# Altium schematic sheet Sheet1.SchDoc
size A0; SheetNumber: 1; SheetTotal: 1
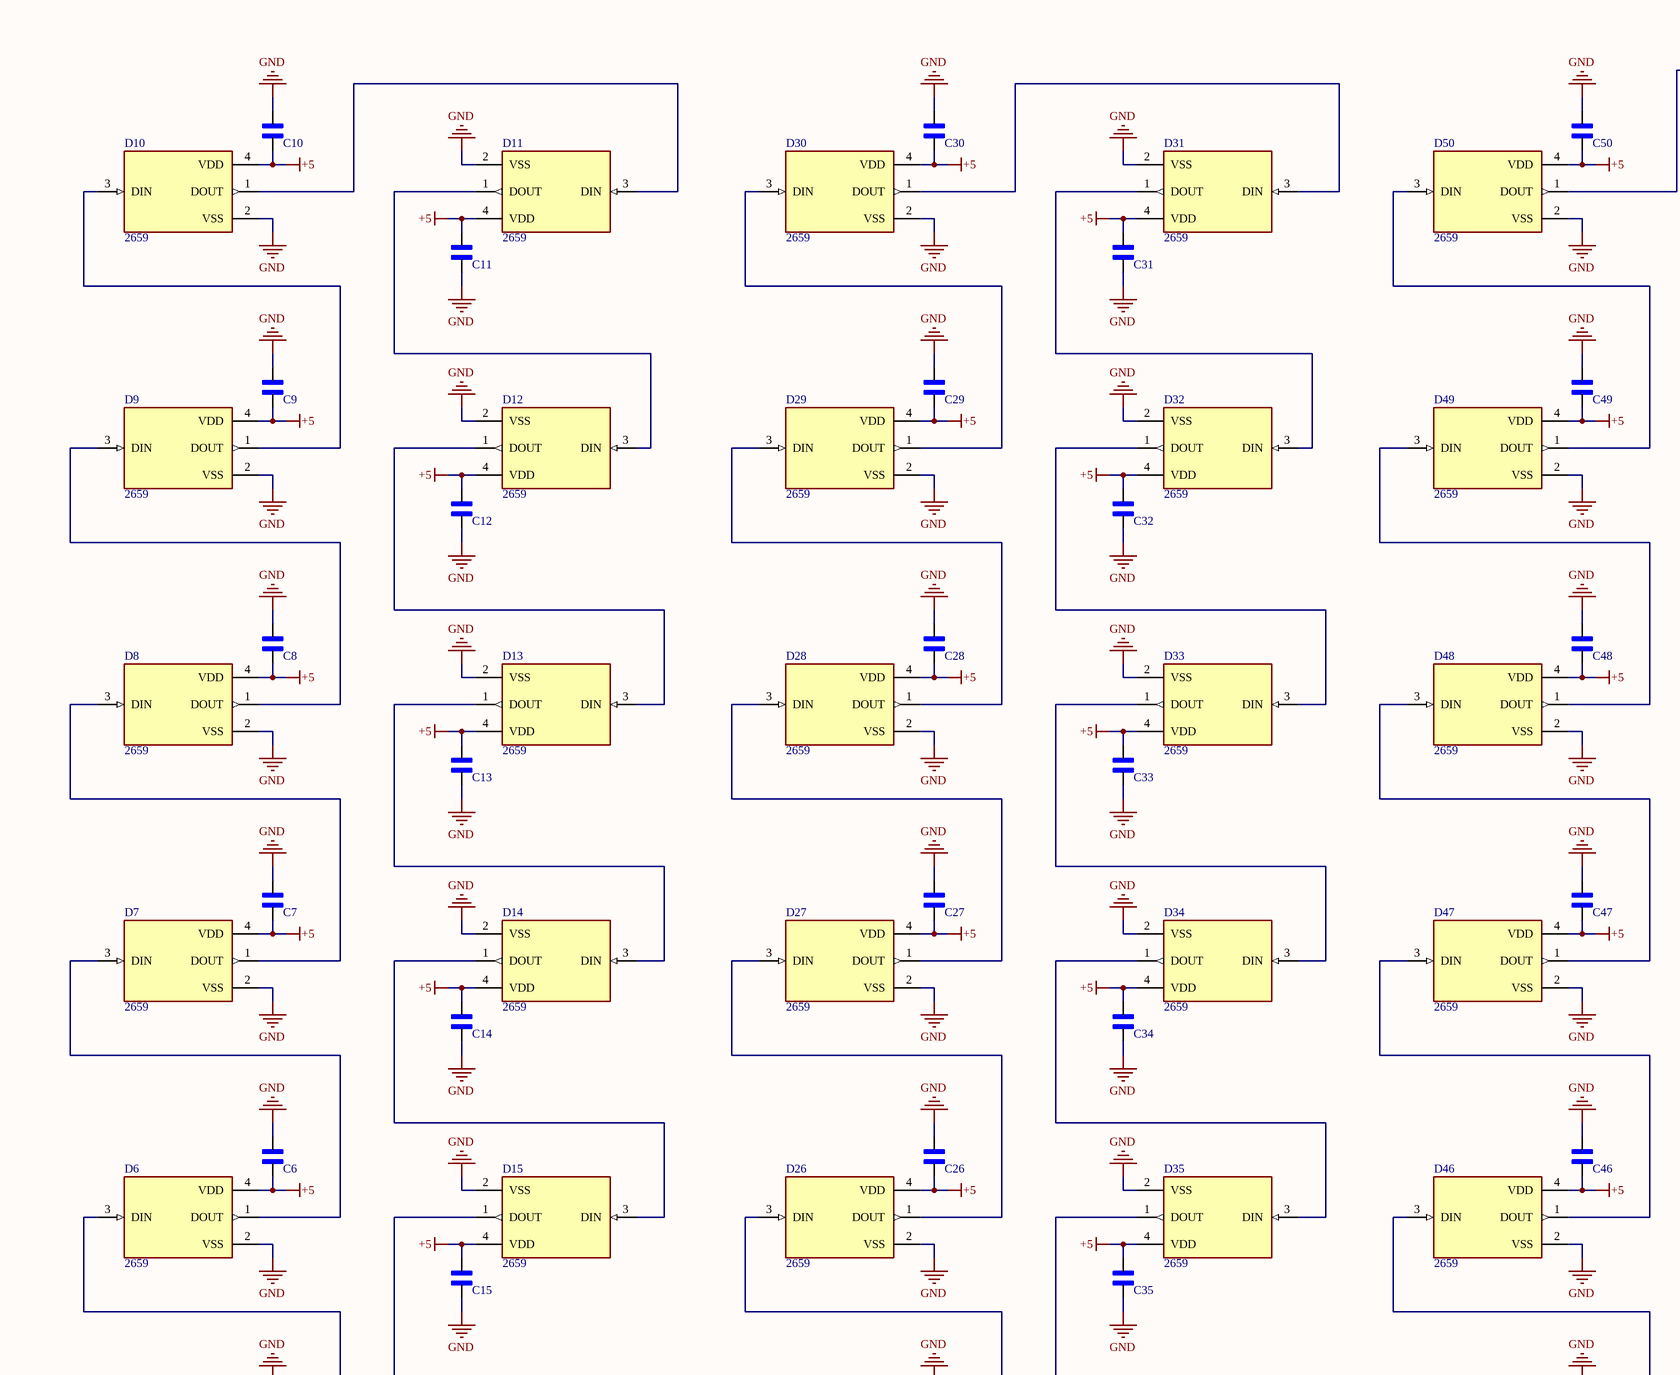
[diagram p0: Sheet1.SchDoc, top left]
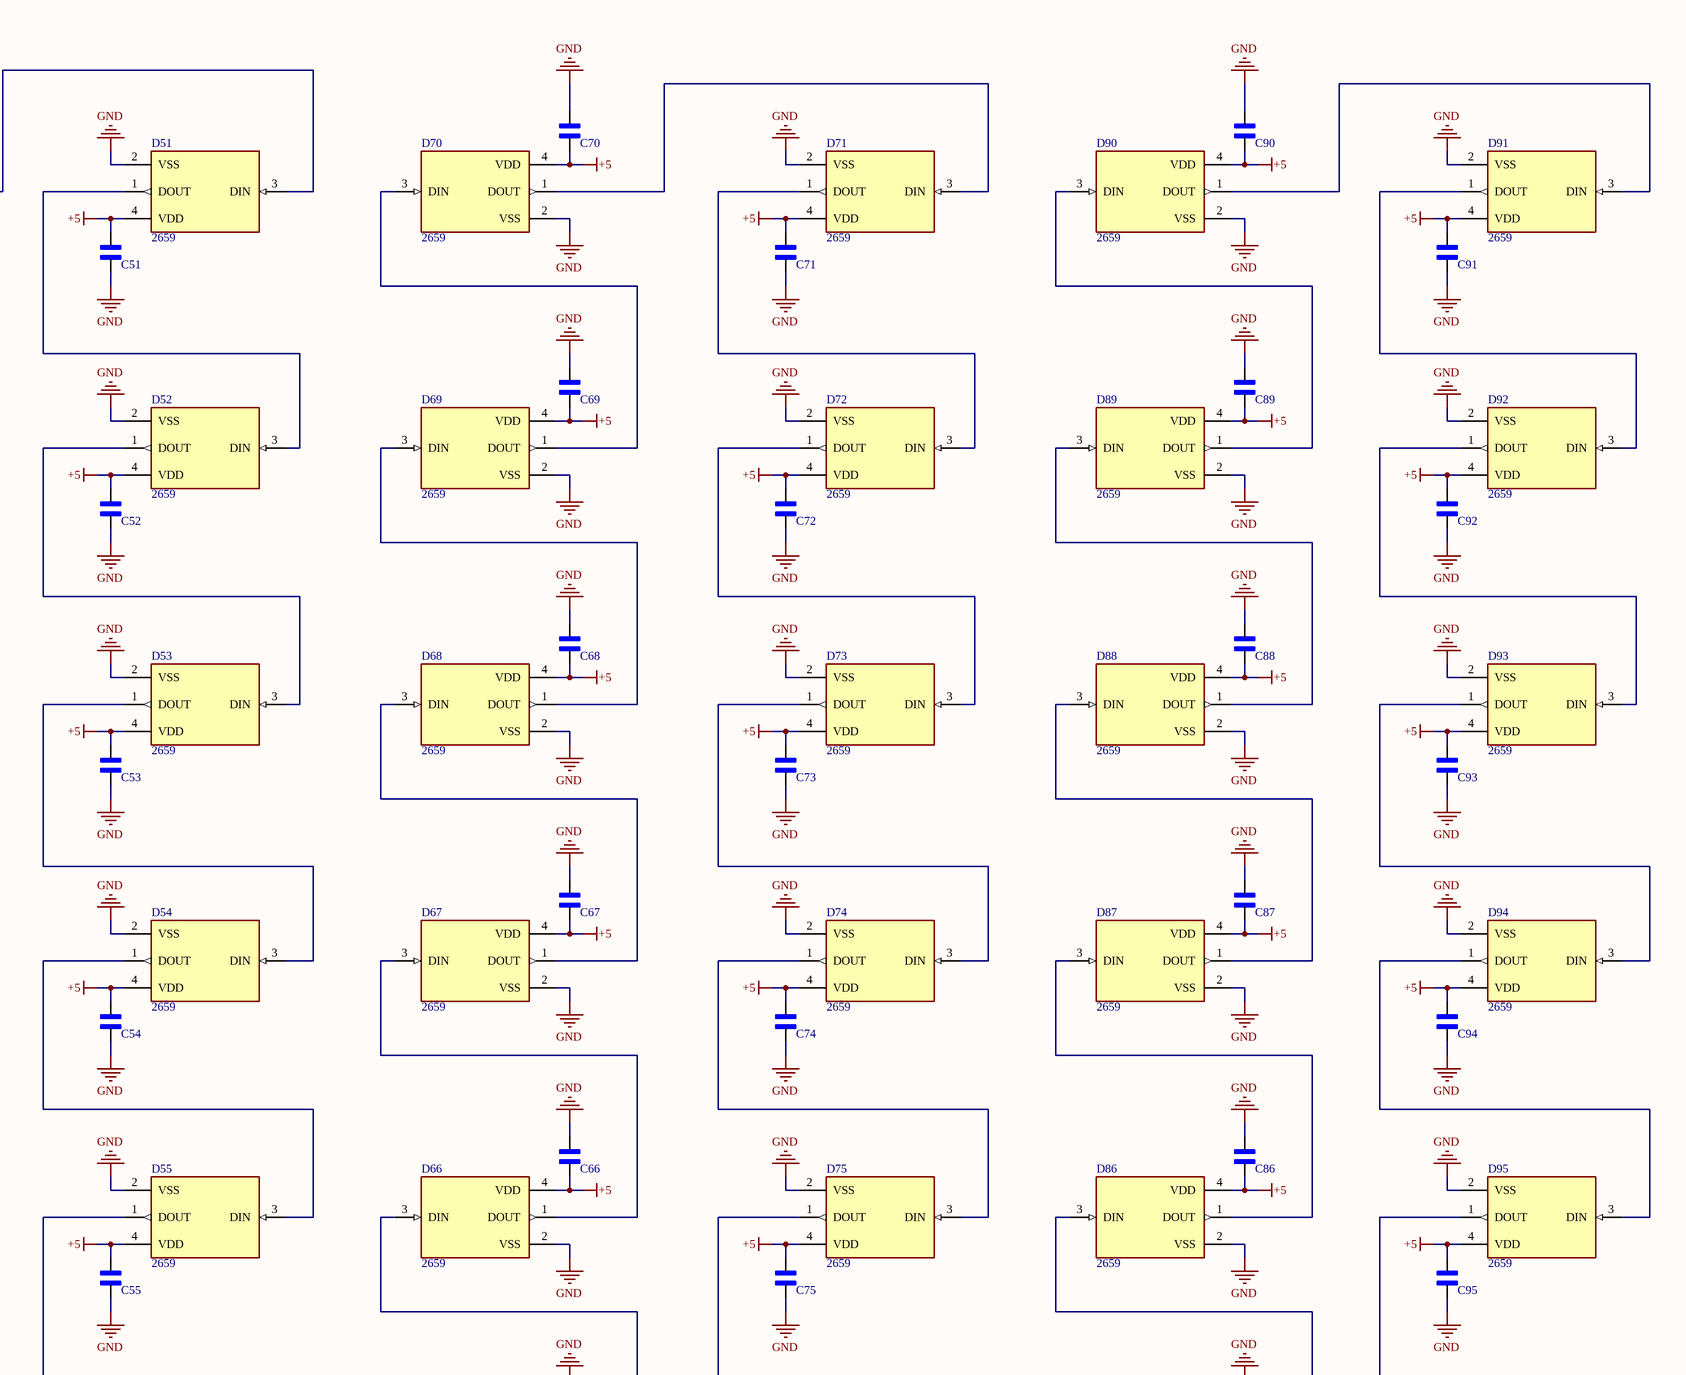
[diagram p1: Sheet1.SchDoc, top right]
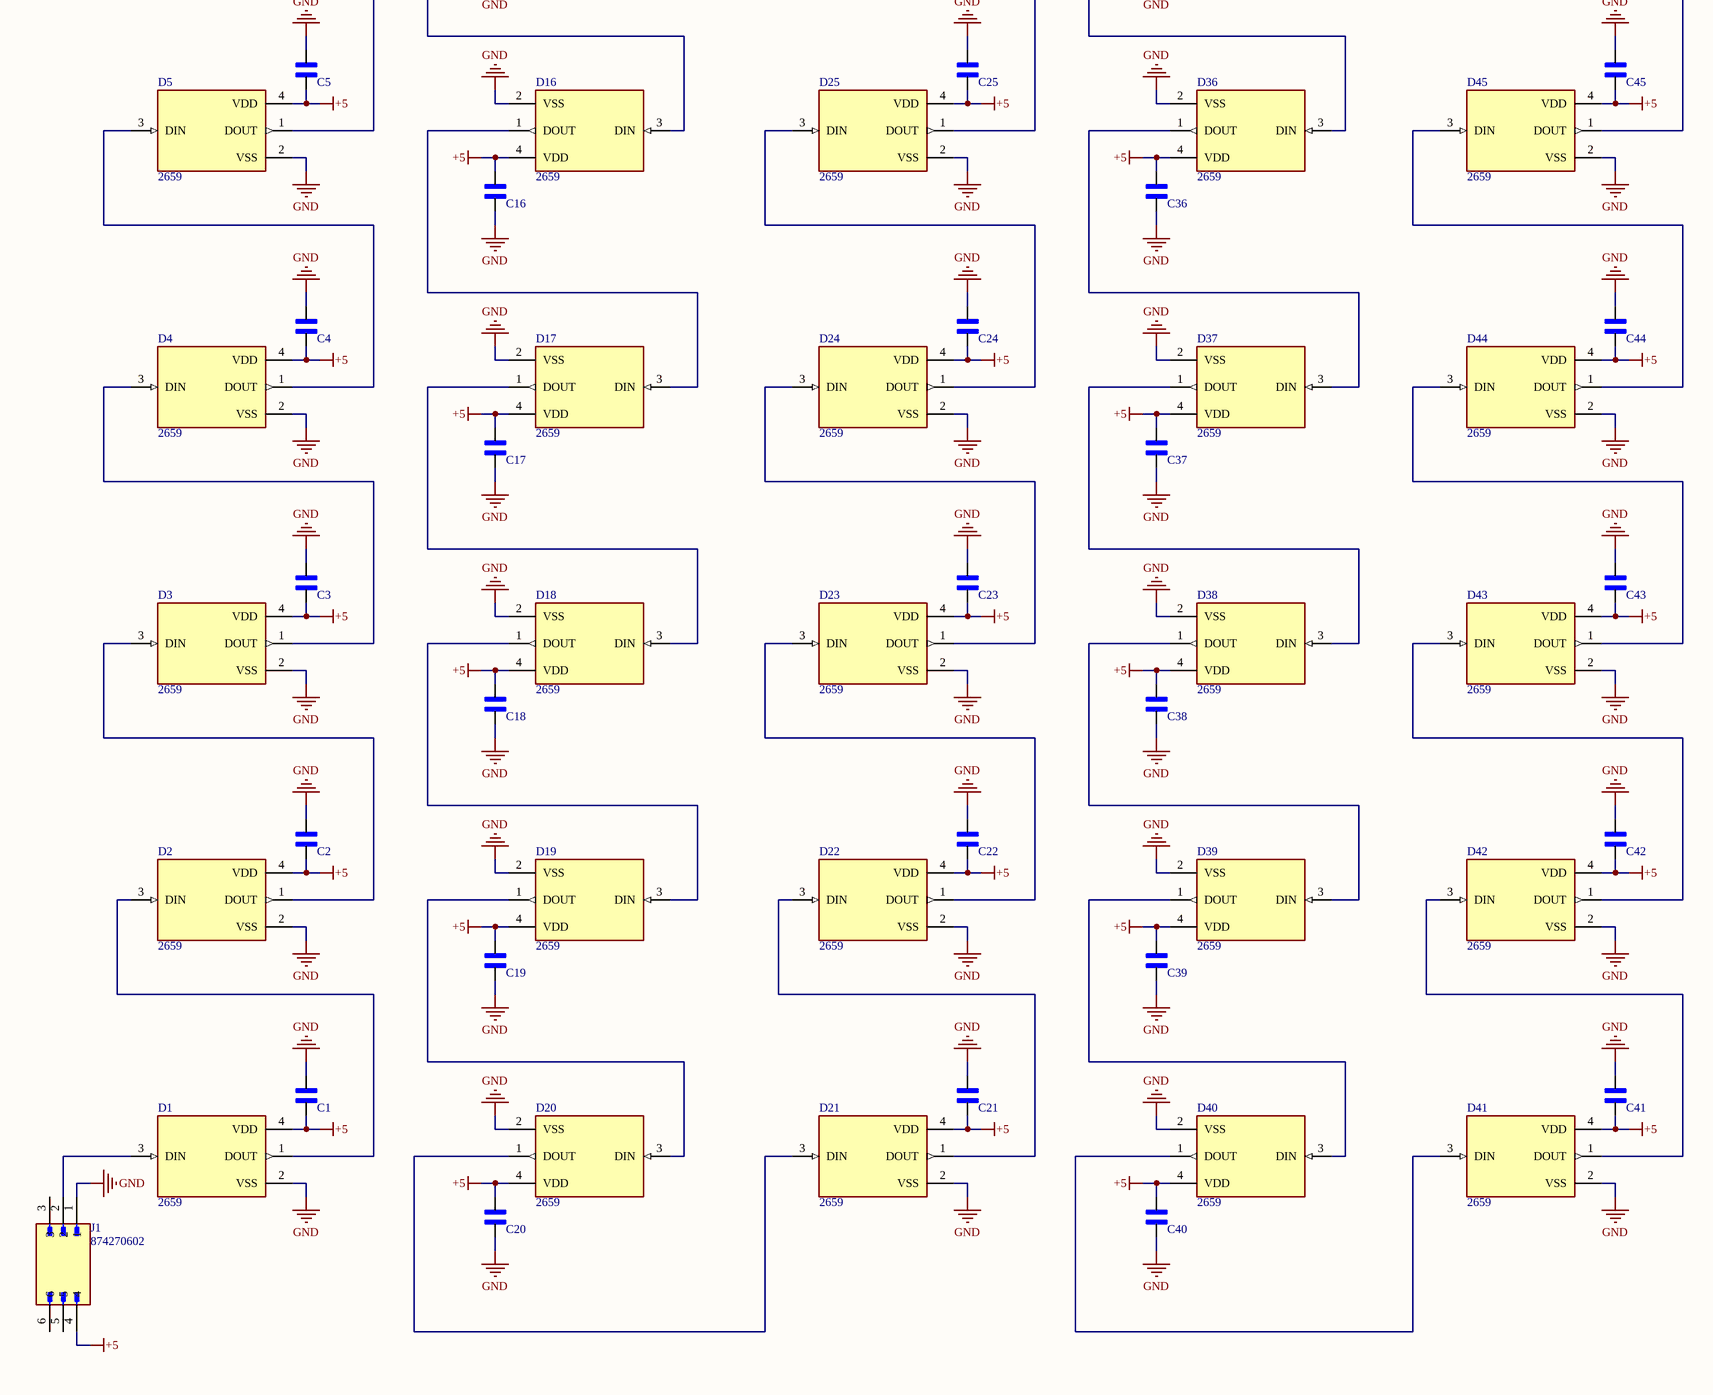
[diagram p2: Sheet1.SchDoc, bottom left]
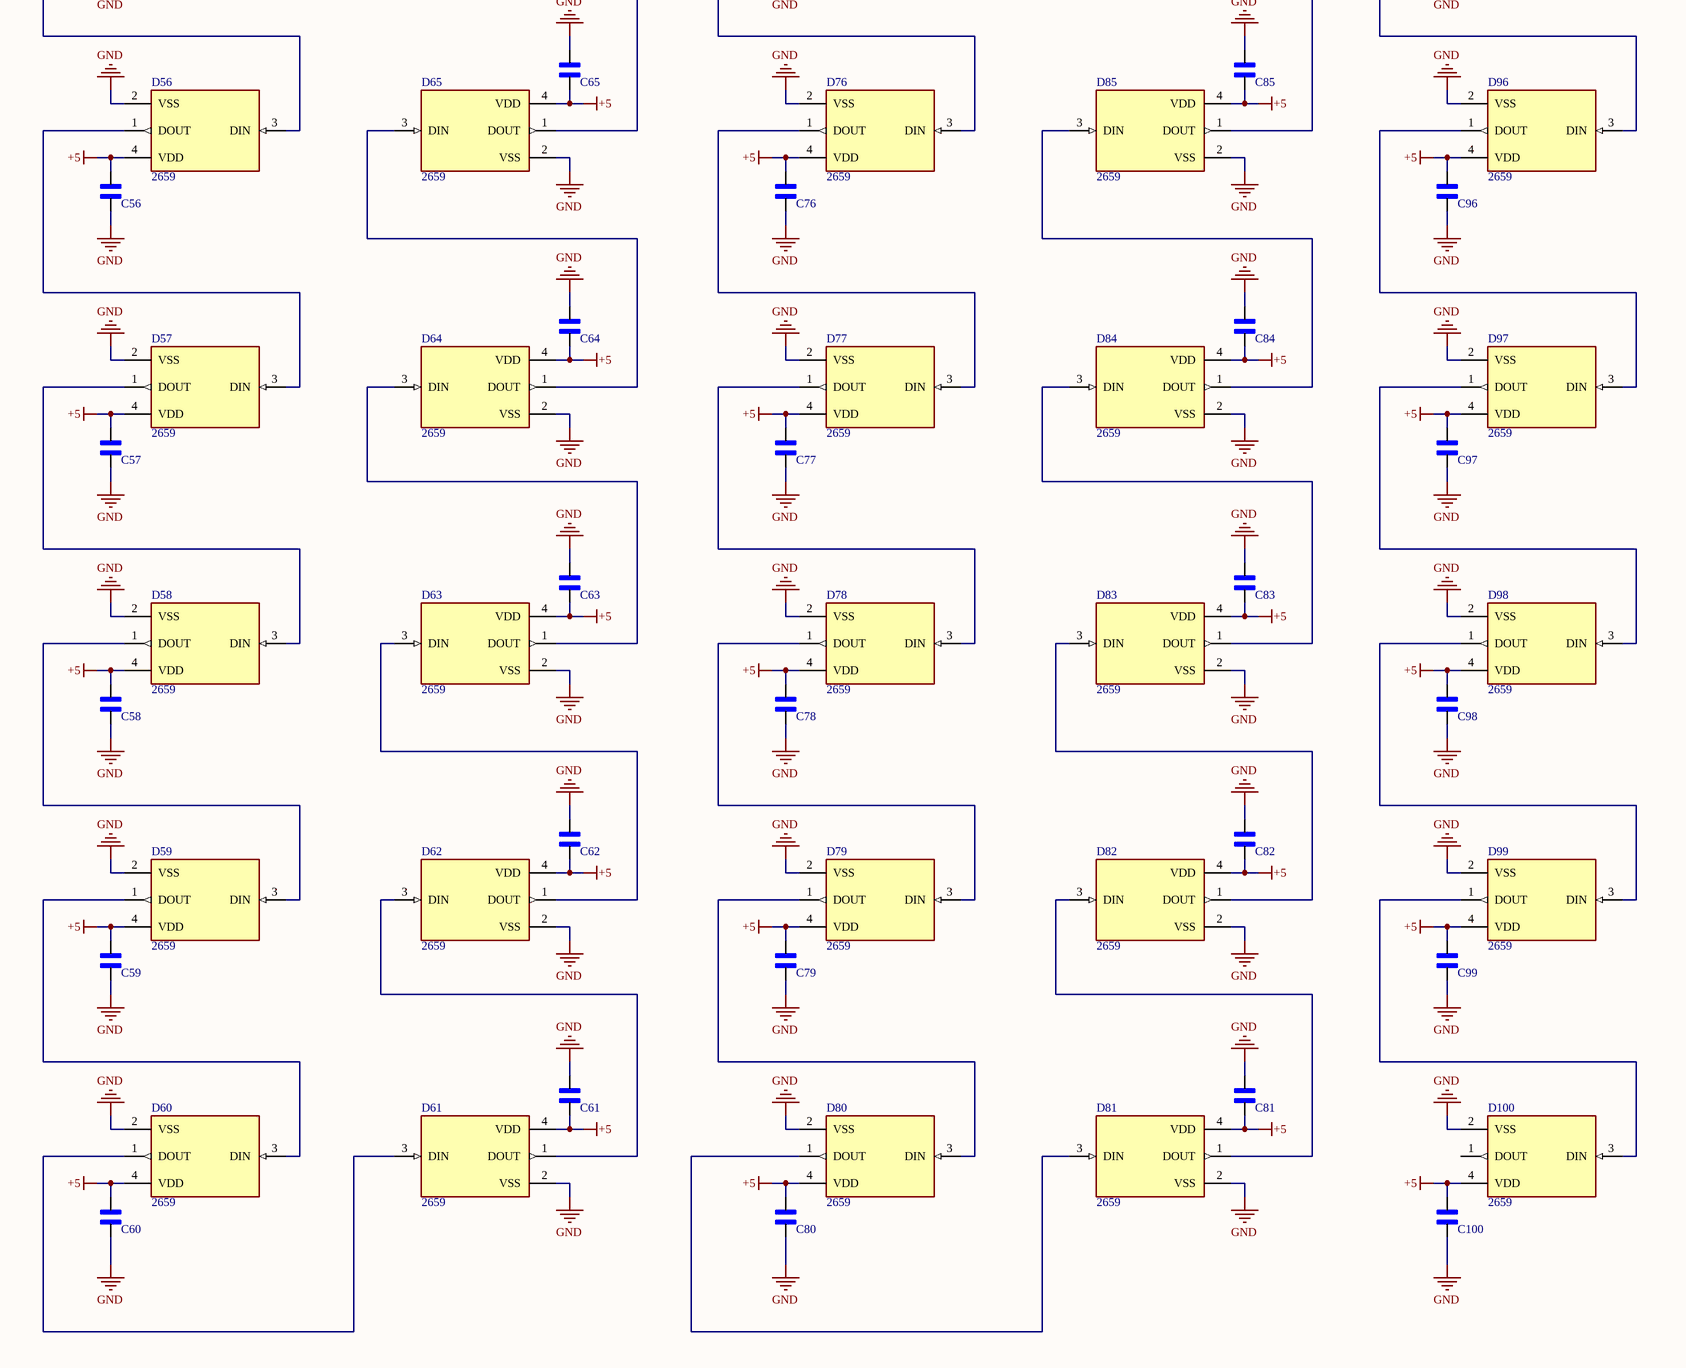
[diagram p3: Sheet1.SchDoc, bottom right]

## Parts
C1  CL10B104KB8NNNC  [CAPC1608X90N]  (value not drawn)
C2  CL10B104KB8NNNC  [CAPC1608X90N]  (value not drawn)
C3  CL10B104KB8NNNC  [CAPC1608X90N]  (value not drawn)
C4  CL10B104KB8NNNC  [CAPC1608X90N]  (value not drawn)
C5  CL10B104KB8NNNC  [CAPC1608X90N]  (value not drawn)
C6  CL10B104KB8NNNC  [CAPC1608X90N]  (value not drawn)
C7  CL10B104KB8NNNC  [CAPC1608X90N]  (value not drawn)
C8  CL10B104KB8NNNC  [CAPC1608X90N]  (value not drawn)
C9  CL10B104KB8NNNC  [CAPC1608X90N]  (value not drawn)
C10  CL10B104KB8NNNC  [CAPC1608X90N]  (value not drawn)
C11  CL10B104KB8NNNC  [CAPC1608X90N]  (value not drawn)
C12  CL10B104KB8NNNC  [CAPC1608X90N]  (value not drawn)
C13  CL10B104KB8NNNC  [CAPC1608X90N]  (value not drawn)
C14  CL10B104KB8NNNC  [CAPC1608X90N]  (value not drawn)
C15  CL10B104KB8NNNC  [CAPC1608X90N]  (value not drawn)
C16  CL10B104KB8NNNC  [CAPC1608X90N]  (value not drawn)
C17  CL10B104KB8NNNC  [CAPC1608X90N]  (value not drawn)
C18  CL10B104KB8NNNC  [CAPC1608X90N]  (value not drawn)
C19  CL10B104KB8NNNC  [CAPC1608X90N]  (value not drawn)
C20  CL10B104KB8NNNC  [CAPC1608X90N]  (value not drawn)
C21  CL10B104KB8NNNC  [CAPC1608X90N]  (value not drawn)
C22  CL10B104KB8NNNC  [CAPC1608X90N]  (value not drawn)
C23  CL10B104KB8NNNC  [CAPC1608X90N]  (value not drawn)
C24  CL10B104KB8NNNC  [CAPC1608X90N]  (value not drawn)
C25  CL10B104KB8NNNC  [CAPC1608X90N]  (value not drawn)
C26  CL10B104KB8NNNC  [CAPC1608X90N]  (value not drawn)
C27  CL10B104KB8NNNC  [CAPC1608X90N]  (value not drawn)
C28  CL10B104KB8NNNC  [CAPC1608X90N]  (value not drawn)
C29  CL10B104KB8NNNC  [CAPC1608X90N]  (value not drawn)
C30  CL10B104KB8NNNC  [CAPC1608X90N]  (value not drawn)
C31  CL10B104KB8NNNC  [CAPC1608X90N]  (value not drawn)
C32  CL10B104KB8NNNC  [CAPC1608X90N]  (value not drawn)
C33  CL10B104KB8NNNC  [CAPC1608X90N]  (value not drawn)
C34  CL10B104KB8NNNC  [CAPC1608X90N]  (value not drawn)
C35  CL10B104KB8NNNC  [CAPC1608X90N]  (value not drawn)
C36  CL10B104KB8NNNC  [CAPC1608X90N]  (value not drawn)
C37  CL10B104KB8NNNC  [CAPC1608X90N]  (value not drawn)
C38  CL10B104KB8NNNC  [CAPC1608X90N]  (value not drawn)
C39  CL10B104KB8NNNC  [CAPC1608X90N]  (value not drawn)
C40  CL10B104KB8NNNC  [CAPC1608X90N]  (value not drawn)
C41  CL10B104KB8NNNC  [CAPC1608X90N]  (value not drawn)
C42  CL10B104KB8NNNC  [CAPC1608X90N]  (value not drawn)
C43  CL10B104KB8NNNC  [CAPC1608X90N]  (value not drawn)
C44  CL10B104KB8NNNC  [CAPC1608X90N]  (value not drawn)
C45  CL10B104KB8NNNC  [CAPC1608X90N]  (value not drawn)
C46  CL10B104KB8NNNC  [CAPC1608X90N]  (value not drawn)
C47  CL10B104KB8NNNC  [CAPC1608X90N]  (value not drawn)
C48  CL10B104KB8NNNC  [CAPC1608X90N]  (value not drawn)
C49  CL10B104KB8NNNC  [CAPC1608X90N]  (value not drawn)
C50  CL10B104KB8NNNC  [CAPC1608X90N]  (value not drawn)
C51  CL10B104KB8NNNC  [CAPC1608X90N]  (value not drawn)
C52  CL10B104KB8NNNC  [CAPC1608X90N]  (value not drawn)
C53  CL10B104KB8NNNC  [CAPC1608X90N]  (value not drawn)
C54  CL10B104KB8NNNC  [CAPC1608X90N]  (value not drawn)
C55  CL10B104KB8NNNC  [CAPC1608X90N]  (value not drawn)
C56  CL10B104KB8NNNC  [CAPC1608X90N]  (value not drawn)
C57  CL10B104KB8NNNC  [CAPC1608X90N]  (value not drawn)
C58  CL10B104KB8NNNC  [CAPC1608X90N]  (value not drawn)
C59  CL10B104KB8NNNC  [CAPC1608X90N]  (value not drawn)
C60  CL10B104KB8NNNC  [CAPC1608X90N]  (value not drawn)
C61  CL10B104KB8NNNC  [CAPC1608X90N]  (value not drawn)
C62  CL10B104KB8NNNC  [CAPC1608X90N]  (value not drawn)
C63  CL10B104KB8NNNC  [CAPC1608X90N]  (value not drawn)
C64  CL10B104KB8NNNC  [CAPC1608X90N]  (value not drawn)
C65  CL10B104KB8NNNC  [CAPC1608X90N]  (value not drawn)
C66  CL10B104KB8NNNC  [CAPC1608X90N]  (value not drawn)
C67  CL10B104KB8NNNC  [CAPC1608X90N]  (value not drawn)
C68  CL10B104KB8NNNC  [CAPC1608X90N]  (value not drawn)
C69  CL10B104KB8NNNC  [CAPC1608X90N]  (value not drawn)
C70  CL10B104KB8NNNC  [CAPC1608X90N]  (value not drawn)
C71  CL10B104KB8NNNC  [CAPC1608X90N]  (value not drawn)
C72  CL10B104KB8NNNC  [CAPC1608X90N]  (value not drawn)
C73  CL10B104KB8NNNC  [CAPC1608X90N]  (value not drawn)
C74  CL10B104KB8NNNC  [CAPC1608X90N]  (value not drawn)
C75  CL10B104KB8NNNC  [CAPC1608X90N]  (value not drawn)
C76  CL10B104KB8NNNC  [CAPC1608X90N]  (value not drawn)
C77  CL10B104KB8NNNC  [CAPC1608X90N]  (value not drawn)
C78  CL10B104KB8NNNC  [CAPC1608X90N]  (value not drawn)
C79  CL10B104KB8NNNC  [CAPC1608X90N]  (value not drawn)
C80  CL10B104KB8NNNC  [CAPC1608X90N]  (value not drawn)
C81  CL10B104KB8NNNC  [CAPC1608X90N]  (value not drawn)
C82  CL10B104KB8NNNC  [CAPC1608X90N]  (value not drawn)
C83  CL10B104KB8NNNC  [CAPC1608X90N]  (value not drawn)
C84  CL10B104KB8NNNC  [CAPC1608X90N]  (value not drawn)
C85  CL10B104KB8NNNC  [CAPC1608X90N]  (value not drawn)
C86  CL10B104KB8NNNC  [CAPC1608X90N]  (value not drawn)
C87  CL10B104KB8NNNC  [CAPC1608X90N]  (value not drawn)
C88  CL10B104KB8NNNC  [CAPC1608X90N]  (value not drawn)
C89  CL10B104KB8NNNC  [CAPC1608X90N]  (value not drawn)
C90  CL10B104KB8NNNC  [CAPC1608X90N]  (value not drawn)
C91  CL10B104KB8NNNC  [CAPC1608X90N]  (value not drawn)
C92  CL10B104KB8NNNC  [CAPC1608X90N]  (value not drawn)
C93  CL10B104KB8NNNC  [CAPC1608X90N]  (value not drawn)
C94  CL10B104KB8NNNC  [CAPC1608X90N]  (value not drawn)
C95  CL10B104KB8NNNC  [CAPC1608X90N]  (value not drawn)
C96  CL10B104KB8NNNC  [CAPC1608X90N]  (value not drawn)
C97  CL10B104KB8NNNC  [CAPC1608X90N]  (value not drawn)
C98  CL10B104KB8NNNC  [CAPC1608X90N]  (value not drawn)
C99  CL10B104KB8NNNC  [CAPC1608X90N]  (value not drawn)
C100  CL10B104KB8NNNC  [CAPC1608X90N]  (value not drawn)
D1  2659  [2659]
D2  2659  [2659]
D3  2659  [2659]
D4  2659  [2659]
D5  2659  [2659]
D6  2659  [2659]
D7  2659  [2659]
D8  2659  [2659]
D9  2659  [2659]
D10  2659  [2659]
D11  2659  [2659]
D12  2659  [2659]
D13  2659  [2659]
D14  2659  [2659]
D15  2659  [2659]
D16  2659  [2659]
D17  2659  [2659]
D18  2659  [2659]
D19  2659  [2659]
D20  2659  [2659]
D21  2659  [2659]
D22  2659  [2659]
D23  2659  [2659]
D24  2659  [2659]
D25  2659  [2659]
D26  2659  [2659]
D27  2659  [2659]
D28  2659  [2659]
D29  2659  [2659]
D30  2659  [2659]
D31  2659  [2659]
D32  2659  [2659]
D33  2659  [2659]
D34  2659  [2659]
D35  2659  [2659]
D36  2659  [2659]
D37  2659  [2659]
D38  2659  [2659]
D39  2659  [2659]
D40  2659  [2659]
D41  2659  [2659]
D42  2659  [2659]
D43  2659  [2659]
D44  2659  [2659]
D45  2659  [2659]
D46  2659  [2659]
D47  2659  [2659]
D48  2659  [2659]
D49  2659  [2659]
D50  2659  [2659]
D51  2659  [2659]
D52  2659  [2659]
D53  2659  [2659]
D54  2659  [2659]
D55  2659  [2659]
D56  2659  [2659]
D57  2659  [2659]
D58  2659  [2659]
D59  2659  [2659]
D60  2659  [2659]
D61  2659  [2659]
D62  2659  [2659]
D63  2659  [2659]
D64  2659  [2659]
D65  2659  [2659]
D66  2659  [2659]
D67  2659  [2659]
D68  2659  [2659]
D69  2659  [2659]
D70  2659  [2659]
D71  2659  [2659]
D72  2659  [2659]
D73  2659  [2659]
D74  2659  [2659]
D75  2659  [2659]
D76  2659  [2659]
D77  2659  [2659]
D78  2659  [2659]
D79  2659  [2659]
D80  2659  [2659]
D81  2659  [2659]
D82  2659  [2659]
D83  2659  [2659]
D84  2659  [2659]
D85  2659  [2659]
D86  2659  [2659]
D87  2659  [2659]
D88  2659  [2659]
D89  2659  [2659]
D90  2659  [2659]
D91  2659  [2659]
D92  2659  [2659]
D93  2659  [2659]
D94  2659  [2659]
D95  2659  [2659]
D96  2659  [2659]
D97  2659  [2659]
D98  2659  [2659]
D99  2659  [2659]
D100  2659  [2659]
J1  874270602  [MOLEX_874270602]

## Nets
+5: C1.1 C2.1 C3.1 C4.1 C5.1 C6.1 C7.1 C8.1 C9.1 C10.1 C11.1 C12.1 C13.1 C14.1 C15.1 C16.1 C17.1 C18.1 C19.1 C20.1 C21.1 C22.1 C23.1 C24.1 C25.1 C26.1 C27.1 C28.1 C29.1 C30.1 C31.1 C32.1 C33.1 C34.1 C35.1 C36.1 C37.1 C38.1 C39.1 C40.1 C41.1 C42.1 C43.1 C44.1 C45.1 C46.1 C47.1 C48.1 C49.1 C50.1 C51.1 C52.1 C53.1 C54.1 C55.1 C56.1 C57.1 C58.1 C59.1 C60.1 C61.1 C62.1 C63.1 C64.1 C65.1 C66.1 C67.1 C68.1 C69.1 C70.1 C71.1 C72.1 C73.1 C74.1 C75.1 C76.1 C77.1 C78.1 C79.1 C80.1 C81.1 C82.1 C83.1 C84.1 C85.1 C86.1 C87.1 C88.1 C89.1 C90.1 C91.1 C92.1 C93.1 C94.1 C95.1 C96.1 C97.1 C98.1 C99.1 C100.1 D1.4(VDD) D2.4(VDD) D3.4(VDD) D4.4(VDD) D5.4(VDD) D6.4(VDD) D7.4(VDD) D8.4(VDD) D9.4(VDD) D10.4(VDD) D11.4(VDD) D12.4(VDD) D13.4(VDD) D14.4(VDD) D15.4(VDD) D16.4(VDD) D17.4(VDD) D18.4(VDD) D19.4(VDD) D20.4(VDD) D21.4(VDD) D22.4(VDD) D23.4(VDD) D24.4(VDD) D25.4(VDD) D26.4(VDD) D27.4(VDD) D28.4(VDD) D29.4(VDD) D30.4(VDD) D31.4(VDD) D32.4(VDD) D33.4(VDD) D34.4(VDD) D35.4(VDD) D36.4(VDD) D37.4(VDD) D38.4(VDD) D39.4(VDD) D40.4(VDD) D41.4(VDD) D42.4(VDD) D43.4(VDD) D44.4(VDD) D45.4(VDD) D46.4(VDD) D47.4(VDD) D48.4(VDD) D49.4(VDD) D50.4(VDD) D51.4(VDD) D52.4(VDD) D53.4(VDD) D54.4(VDD) D55.4(VDD) D56.4(VDD) D57.4(VDD) D58.4(VDD) D59.4(VDD) D60.4(VDD) D61.4(VDD) D62.4(VDD) D63.4(VDD) D64.4(VDD) D65.4(VDD) D66.4(VDD) D67.4(VDD) D68.4(VDD) D69.4(VDD) D70.4(VDD) D71.4(VDD) D72.4(VDD) D73.4(VDD) D74.4(VDD) D75.4(VDD) D76.4(VDD) D77.4(VDD) D78.4(VDD) D79.4(VDD) D80.4(VDD) D81.4(VDD) D82.4(VDD) D83.4(VDD) D84.4(VDD) D85.4(VDD) D86.4(VDD) D87.4(VDD) D88.4(VDD) D89.4(VDD) D90.4(VDD) D91.4(VDD) D92.4(VDD) D93.4(VDD) D94.4(VDD) D95.4(VDD) D96.4(VDD) D97.4(VDD) D98.4(VDD) D99.4(VDD) D100.4(VDD) J1.4
GND: C1.2 C2.2 C3.2 C4.2 C5.2 C6.2 C7.2 C8.2 C9.2 C10.2 C11.2 C12.2 C13.2 C14.2 C15.2 C16.2 C17.2 C18.2 C19.2 C20.2 C21.2 C22.2 C23.2 C24.2 C25.2 C26.2 C27.2 C28.2 C29.2 C30.2 C31.2 C32.2 C33.2 C34.2 C35.2 C36.2 C37.2 C38.2 C39.2 C40.2 C41.2 C42.2 C43.2 C44.2 C45.2 C46.2 C47.2 C48.2 C49.2 C50.2 C51.2 C52.2 C53.2 C54.2 C55.2 C56.2 C57.2 C58.2 C59.2 C60.2 C61.2 C62.2 C63.2 C64.2 C65.2 C66.2 C67.2 C68.2 C69.2 C70.2 C71.2 C72.2 C73.2 C74.2 C75.2 C76.2 C77.2 C78.2 C79.2 C80.2 C81.2 C82.2 C83.2 C84.2 C85.2 C86.2 C87.2 C88.2 C89.2 C90.2 C91.2 C92.2 C93.2 C94.2 C95.2 C96.2 C97.2 C98.2 C99.2 C100.2 D1.2(VSS) D2.2(VSS) D3.2(VSS) D4.2(VSS) D5.2(VSS) D6.2(VSS) D7.2(VSS) D8.2(VSS) D9.2(VSS) D10.2(VSS) D11.2(VSS) D12.2(VSS) D13.2(VSS) D14.2(VSS) D15.2(VSS) D16.2(VSS) D17.2(VSS) D18.2(VSS) D19.2(VSS) D20.2(VSS) D21.2(VSS) D22.2(VSS) D23.2(VSS) D24.2(VSS) D25.2(VSS) D26.2(VSS) D27.2(VSS) D28.2(VSS) D29.2(VSS) D30.2(VSS) D31.2(VSS) D32.2(VSS) D33.2(VSS) D34.2(VSS) D35.2(VSS) D36.2(VSS) D37.2(VSS) D38.2(VSS) D39.2(VSS) D40.2(VSS) D41.2(VSS) D42.2(VSS) D43.2(VSS) D44.2(VSS) D45.2(VSS) D46.2(VSS) D47.2(VSS) D48.2(VSS) D49.2(VSS) D50.2(VSS) D51.2(VSS) D52.2(VSS) D53.2(VSS) D54.2(VSS) D55.2(VSS) D56.2(VSS) D57.2(VSS) D58.2(VSS) D59.2(VSS) D60.2(VSS) D61.2(VSS) D62.2(VSS) D63.2(VSS) D64.2(VSS) D65.2(VSS) D66.2(VSS) D67.2(VSS) D68.2(VSS) D69.2(VSS) D70.2(VSS) D71.2(VSS) D72.2(VSS) D73.2(VSS) D74.2(VSS) D75.2(VSS) D76.2(VSS) D77.2(VSS) D78.2(VSS) D79.2(VSS) D80.2(VSS) D81.2(VSS) D82.2(VSS) D83.2(VSS) D84.2(VSS) D85.2(VSS) D86.2(VSS) D87.2(VSS) D88.2(VSS) D89.2(VSS) D90.2(VSS) D91.2(VSS) D92.2(VSS) D93.2(VSS) D94.2(VSS) D95.2(VSS) D96.2(VSS) D97.2(VSS) D98.2(VSS) D99.2(VSS) D100.2(VSS) J1.1
NetD1_1: D1.1(DOUT) D2.3(DIN)
NetD1_3: D1.3(DIN) J1.2
NetD2_1: D2.1(DOUT) D3.3(DIN)
NetD3_1: D3.1(DOUT) D4.3(DIN)
NetD4_1: D4.1(DOUT) D5.3(DIN)
NetD5_1: D5.1(DOUT) D6.3(DIN)
NetD6_1: D6.1(DOUT) D7.3(DIN)
NetD7_1: D7.1(DOUT) D8.3(DIN)
NetD8_1: D8.1(DOUT) D9.3(DIN)
NetD9_1: D9.1(DOUT) D10.3(DIN)
NetD10_1: D10.1(DOUT) D11.3(DIN)
NetD11_1: D11.1(DOUT) D12.3(DIN)
NetD12_1: D12.1(DOUT) D13.3(DIN)
NetD13_1: D13.1(DOUT) D14.3(DIN)
NetD14_1: D14.1(DOUT) D15.3(DIN)
NetD15_1: D15.1(DOUT) D16.3(DIN)
NetD16_1: D16.1(DOUT) D17.3(DIN)
NetD17_1: D17.1(DOUT) D18.3(DIN)
NetD18_1: D18.1(DOUT) D19.3(DIN)
NetD19_1: D19.1(DOUT) D20.3(DIN)
NetD20_1: D20.1(DOUT) D21.3(DIN)
NetD21_1: D21.1(DOUT) D22.3(DIN)
NetD22_1: D22.1(DOUT) D23.3(DIN)
NetD23_1: D23.1(DOUT) D24.3(DIN)
NetD24_1: D24.1(DOUT) D25.3(DIN)
NetD25_1: D25.1(DOUT) D26.3(DIN)
NetD26_1: D26.1(DOUT) D27.3(DIN)
NetD27_1: D27.1(DOUT) D28.3(DIN)
NetD28_1: D28.1(DOUT) D29.3(DIN)
NetD29_1: D29.1(DOUT) D30.3(DIN)
NetD30_1: D30.1(DOUT) D31.3(DIN)
NetD31_1: D31.1(DOUT) D32.3(DIN)
NetD32_1: D32.1(DOUT) D33.3(DIN)
NetD33_1: D33.1(DOUT) D34.3(DIN)
NetD34_1: D34.1(DOUT) D35.3(DIN)
NetD35_1: D35.1(DOUT) D36.3(DIN)
NetD36_1: D36.1(DOUT) D37.3(DIN)
NetD37_1: D37.1(DOUT) D38.3(DIN)
NetD38_1: D38.1(DOUT) D39.3(DIN)
NetD39_1: D39.1(DOUT) D40.3(DIN)
NetD40_1: D40.1(DOUT) D41.3(DIN)
NetD41_1: D41.1(DOUT) D42.3(DIN)
NetD42_1: D42.1(DOUT) D43.3(DIN)
NetD43_1: D43.1(DOUT) D44.3(DIN)
NetD44_1: D44.1(DOUT) D45.3(DIN)
NetD45_1: D45.1(DOUT) D46.3(DIN)
NetD46_1: D46.1(DOUT) D47.3(DIN)
NetD47_1: D47.1(DOUT) D48.3(DIN)
NetD48_1: D48.1(DOUT) D49.3(DIN)
NetD49_1: D49.1(DOUT) D50.3(DIN)
NetD50_1: D50.1(DOUT) D51.3(DIN)
NetD51_1: D51.1(DOUT) D52.3(DIN)
NetD52_1: D52.1(DOUT) D53.3(DIN)
NetD53_1: D53.1(DOUT) D54.3(DIN)
NetD54_1: D54.1(DOUT) D55.3(DIN)
NetD55_1: D55.1(DOUT) D56.3(DIN)
NetD56_1: D56.1(DOUT) D57.3(DIN)
NetD57_1: D57.1(DOUT) D58.3(DIN)
NetD58_1: D58.1(DOUT) D59.3(DIN)
NetD59_1: D59.1(DOUT) D60.3(DIN)
NetD60_1: D60.1(DOUT) D61.3(DIN)
NetD61_1: D61.1(DOUT) D62.3(DIN)
NetD62_1: D62.1(DOUT) D63.3(DIN)
NetD63_1: D63.1(DOUT) D64.3(DIN)
NetD64_1: D64.1(DOUT) D65.3(DIN)
NetD65_1: D65.1(DOUT) D66.3(DIN)
NetD66_1: D66.1(DOUT) D67.3(DIN)
NetD67_1: D67.1(DOUT) D68.3(DIN)
NetD68_1: D68.1(DOUT) D69.3(DIN)
NetD69_1: D69.1(DOUT) D70.3(DIN)
NetD70_1: D70.1(DOUT) D71.3(DIN)
NetD71_1: D71.1(DOUT) D72.3(DIN)
NetD72_1: D72.1(DOUT) D73.3(DIN)
NetD73_1: D73.1(DOUT) D74.3(DIN)
NetD74_1: D74.1(DOUT) D75.3(DIN)
NetD75_1: D75.1(DOUT) D76.3(DIN)
NetD76_1: D76.1(DOUT) D77.3(DIN)
NetD77_1: D77.1(DOUT) D78.3(DIN)
NetD78_1: D78.1(DOUT) D79.3(DIN)
NetD79_1: D79.1(DOUT) D80.3(DIN)
NetD80_1: D80.1(DOUT) D81.3(DIN)
NetD81_1: D81.1(DOUT) D82.3(DIN)
NetD82_1: D82.1(DOUT) D83.3(DIN)
NetD83_1: D83.1(DOUT) D84.3(DIN)
NetD84_1: D84.1(DOUT) D85.3(DIN)
NetD85_1: D85.1(DOUT) D86.3(DIN)
NetD86_1: D86.1(DOUT) D87.3(DIN)
NetD87_1: D87.1(DOUT) D88.3(DIN)
NetD88_1: D88.1(DOUT) D89.3(DIN)
NetD89_1: D89.1(DOUT) D90.3(DIN)
NetD90_1: D90.1(DOUT) D91.3(DIN)
NetD91_1: D91.1(DOUT) D92.3(DIN)
NetD92_1: D92.1(DOUT) D93.3(DIN)
NetD93_1: D93.1(DOUT) D94.3(DIN)
NetD94_1: D94.1(DOUT) D95.3(DIN)
NetD95_1: D95.1(DOUT) D96.3(DIN)
NetD96_1: D96.1(DOUT) D97.3(DIN)
NetD97_1: D97.1(DOUT) D98.3(DIN)
NetD98_1: D98.1(DOUT) D99.3(DIN)
NetD99_1: D99.1(DOUT) D100.3(DIN)

Not connected (* = marked no-connect by the designer): D100 1(DOUT); J1 3 5 6

## Library data of the parts
C1-C100 = CL10B104KB8NNNC: MF: {'manufacturer': u'Samsung Electro-Mechanics'}; Package: None; Price: None; Value: *; MP: CL10B104KB8NNNC; Availability: Unavailable
D1-D100 = CMP-011-000000-2: 20 AWG Hook-Up Wire 26/34 White 300V 40.00' _12.19m_; MF: Adafruit Industries; Design Item ID: 2659; Component Type: Standard; Package: TQFP-32 Adafruit Industries; Pin Count: 4; Digi-Key_Part_Number: 2183-2659-ND; SnapEDA_Link: https://www.snapeda.com/parts/2659/Adafruit%20Industries%20LLC/view-part/548522/?ref=snap; Value: *; MP: 2659; Source: SnapEDAsch.SchLib; Digi-Key_Purchase_URL: https://www.digikey.com/product-detail/en/pololu-corporation/2659/2183-2659-ND/10451102?utm_source=snapeda&utm_medium=aggregator&utm_campaign=symbol
J1 = CMP-002-00072-1: Price: None; Source: 874270602.SchLib; Design Item ID: 874270602; MP: 874270602; Value: *; Pins: 6; Availability: Unavailable; Case/Package: None; Component Type: Standard